# Altium project Warship_stm32f103zet6.PrjPcb
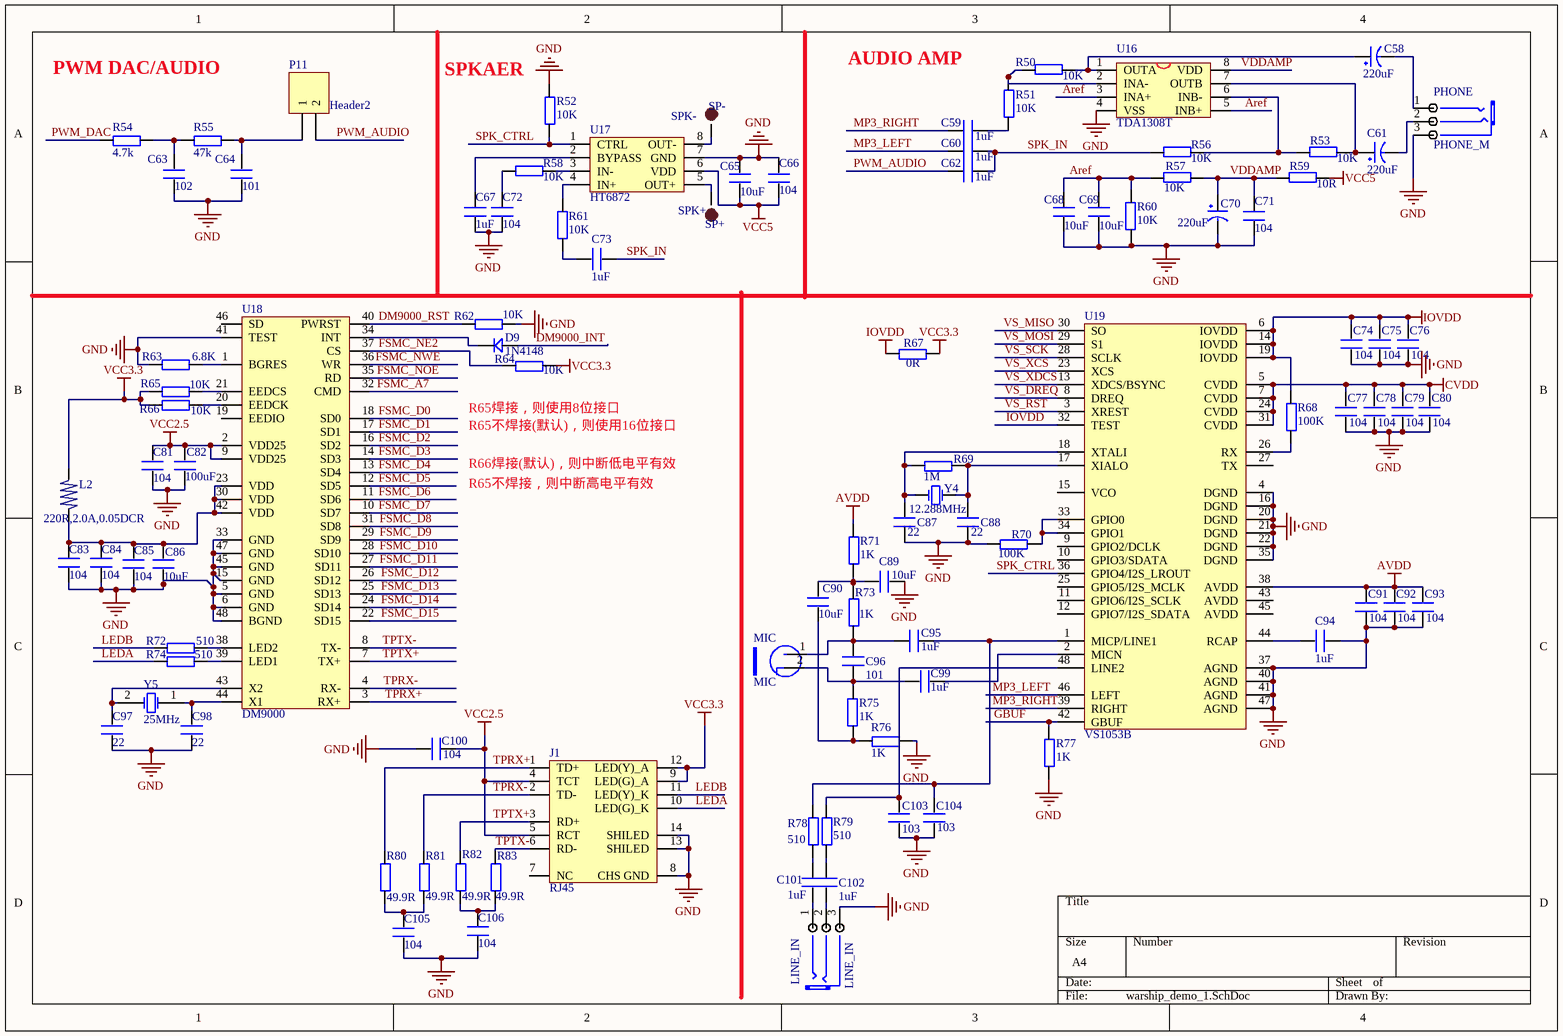
[diagram p0: warship_demo_1.SchDoc]
4 sheets, 272 parts. Net scope: global (net labels, ports and power ports of the same name join across sheets).
Sheets:
  warship_demo_1.SchDoc
  warship_demo_2.SchDoc
  warship_demo_3.SchDoc
  warship_demo_4.SchDoc

## Sheet warship_demo_1.SchDoc
size A4

### Parts
C58  220uF  [CC6.56.5]
C59  1uF  [0603P]
C60  1uF  [0603P]
C61  220uF  [CC6.56.5]
C62  1uF  [0603P]
C63  102  [0603P]
C64  101  [0603P]
C65  10uF  [0805]
C66  104  [0603P]
C67  1uF  [0603P]
C68  10uF  [0805]
C69  10uF  [0805]
C70  220uF  [CC6.56.5]
C71  104  [0603P]
C72  104  [0603P]
C73  1uF  [0603P]
C74  104  [0603P]
C75  104  [0603P]
C76  104  [0603P]
C77  104  [0603P]
C78  104  [0603P]
C79  104  [0603P]
C80  104  [0603P]
C81  104  [0603P]
C82  100uF  [1206]
C83  104  [0603P]
C84  104  [0603P]
C85  104  [0603P]
C86  10uF  [0805]
C87  22  [0603P]
C88  22  [0603P]
C89  10uF  [0805]
C90  10uF  [0805]
C91  104  [0603P]
C92  104  [0603P]
C93  104  [0603P]
C94  1uF  [0603P]
C95  1uF  [0603P]
C96  101  [0603P]
C97  22  [0603P]
C98  22  [0603P]
C99  1uF  [0603P]
C100  104  [0603P]
C101  1uF  [0603P]
C102  1uF  [0603P]
C103  103  [0603P]
C104  103  [0603P]
C105  104  [0603P]
C106  104  [0603P]
D9  1N4148  [DIODE_SOP]
J1  RJ45  [HR911105A]
L2  220R,2.0A,0.05DCR  [0603P]
LINE_IN  LINE_IN  [PHONE_ST]
MIC  MIC  [MIC]
P11  Header2  [HDR1X2]
PHONE  PHONE_M  [PHONE_ST]
R50  10K  [0603P]
R51  10K  [0603P]
R52  10K  [0603P]
R53  10K  [0603P]
R54  4.7k  [0603P]
R55  47k  [0603P]
R56  10K  [0603P]
R57  10K  [0603P]
R58  10K  [0603P]
R59  10R  [0603P]
R60  10K  [0603P]
R61  10K  [0603P]
R62  10K  [0603P]
R63  6.8K  [0603P]
R64  10K  [0603P]
R65  10K  [0603P]
R66  10K  [0603P]
R67  0R  [0603P]
R68  100K  [0603P]
R69  1M  [0603P]
R70  100K  [0603P]
R71  1K  [0603P]
R72  510  [0603P]
R73  1K  [0603P]
R74  510  [0603P]
R75  1K  [0603P]
R76  1K  [0603P]
R77  1K  [0603P]
R78  510  [0603P]
R79  510  [0603P]
R80  49.9R  [0603P]
R81  49.9R  [0603P]
R82  49.9R  [0603P]
R83  49.9R  [0603P]
SP+  SPK+  [TP-1.5]
SP-  SPK-  [TP-1.5]
U16  TDA1308T  [SOP-8]
U17  HT6872  [SOP-8]
U18  DM9000  [mTQFP48]
U19  VS1053B  [mTQFP48]
Y4  12.288MHz  [XTAL_US]
Y5  25MHz  [XTAL_US]

### Nets
AVDD: C91.2 C92.2 C93.2 R71.2 U19.38(AVDD)
CVDD: C77.2 C78.2 C79.2 C80.2 U19.5(CVDD) U19.7(CVDD) U19.24(CVDD) U19.31(CVDD)
GND: C63.1 C64.1 C65.2 C66.1 C67.1 C68.1 C69.1 C70.2(GND) C71.2 C72.1 C74.1 C75.1 C76.1 C77.1 C78.1 C79.1 C80.1 C81.1 C82.1 C83.1 C84.1 C85.1 C86.1 C87.1 C88.2 C89.1 C91.1 C92.1 C93.1 C94.1 C97.1 C98.1 C100.2 C103.1 C104.1 C105.1 C106.1 J1.8(CHS_GND) J1.13(SHILED) J1.14(SHILED) LINE_IN.3(COM) PHONE.3(COM) R52.2 R60.2 R62.2 R63.1 R70.1 R76.2 R77.1 U16.4(VSS) U17.7(GND) U18.5(GND) U18.6(GND) U18.15(GND) U18.33(GND) U18.41(TEST) U18.45(GND) U18.47(GND) U18.48(BGND) U19.4(DGND) U19.16(DGND) U19.20(DGND) U19.21(DGND) U19.22(DGND) U19.35(DGND) U19.37(AGND) U19.40(AGND) U19.41(AGND) U19.47(AGND)
IOVDD: C74.2 C75.2 C76.2 R67.1 R68.2 U19.6(IOVDD) U19.14(IOVDD) U19.19(IOVDD) U19.32(TEST)
VCC2.5: C81.2 C82.2 C100.1 J1.4(TCT) J1.5(RCT) U18.2(VDD25) U18.9(VDD25)
VCC3.3: J1.9(LED(G)_A) J1.12(LED(Y)_A) L2.1 R64.2 R65.1 R66.1 R67.2
VCC5: C65.1 C66.2 R59.1 U17.6(VDD)
Aref: C68.2 C69.2 R57.2 R60.1 U16.3(INA+) U16.5(INB+)
DM9000_INT: D9.1
DM9000_RST: R62.1 U18.40(PWRST)
FSMC_A7: U18.32(CMD)
FSMC_D0: U18.18(SD0)
FSMC_D1: U18.17(SD1)
FSMC_D2: U18.16(SD2)
FSMC_D3: U18.14(SD3)
FSMC_D4: U18.13(SD4)
FSMC_D5: U18.12(SD5)
FSMC_D6: U18.11(SD6)
FSMC_D7: U18.10(SD7)
FSMC_D8: U18.31(SD8)
FSMC_D9: U18.29(SD9)
FSMC_D10: U18.28(SD10)
FSMC_D11: U18.27(SD11)
FSMC_D12: U18.26(SD12)
FSMC_D13: U18.25(SD13)
FSMC_D14: U18.24(SD14)
FSMC_D15: U18.22(SD15)
FSMC_NE2: R64.1 U18.37(CS)
FSMC_NOE: U18.35(RD)
FSMC_NWE: U18.36(WR)
GBUF: R77.2 U19.42(GBUF)
LEDA: J1.10(LED(G)_K) R74.1
LEDB: J1.11(LED(Y)_K) R72.1
MP3_LEFT: C60.2 U19.46(LEFT)
MP3_RIGHT: C59.2 U19.39(RIGHT)
PWM_AUDIO: C62.2 P11.2
PWM_DAC: R54.1  [project net OV_VSYNC]
SPK_CTRL: R52.1 U17.1(CTRL) U19.36(GPIO4/I2S_LROUT)
SPK_IN: C60.1 C62.1 C73.1 R56.2
TPRX+: J1.1(TD+) R80.2 U18.3(RX+)
TPRX-: J1.2(TD-) R81.2 U18.4(RX-)
TPTX+: J1.3(RD+) R82.2 U18.7(TX+)
TPTX-: J1.6(RD-) R83.2 U18.8(TX-)
VDDAMP: C70.1(VCC) C71.1 R57.1 R59.2 U16.8(VDD)
VS_DREQ: U19.8(DREQ)  [project net PC13]
VS_MISO: U19.30(SO)  [project net PA6]
VS_MOSI: U19.29(S1)  [project net PA7]
VS_RST: U19.3(XREST)  [project net PE6]
VS_SCK: U19.28(SCLK)  [project net PA5]
VS_XCS: U19.23(XCS)  [project net PF7]
VS_XDCS: U19.13(XDCS/BSYNC)  [project net PF6]
NetC58_1: C58.1(VCC) R50.1 U16.1(OUTA)
NetC58_2: C58.2(GND) PHONE.1(CHL)
NetC59_1: C59.1 R51.1
NetC61_1: C61.1(VCC) R53.1 U16.7(OUTB)
NetC61_2: C61.2(GND) PHONE.2(CHR)
NetC63_2: C63.2 R54.2 R55.1
NetC64_2: C64.2 P11.1 R55.2
NetC67_2: C67.2 U17.2(BYPASS)
NetC72_2: C72.2 R58.2
NetC73_2: C73.2 R61.2
NetC83_2: C83.2 C84.2 C85.2 C86.2 L2.2 U18.23(VDD) U18.30(VDD) U18.42(VDD)
NetC87_2: C87.2 R69.1 U19.18(XTALI) Y4.1(OSC1)
NetC88_1: C88.1 R69.2 U19.17(XIALO) Y4.2(OSC2)
NetC89_2: C89.2 C90.2 R71.1 R73.2
NetC90_1: C90.1 R75.2 R76.1
NetC94_2: C94.2 U19.44(RCAP)
NetC95_1: C95.1 C96.2 MIC.1(VCC) R73.1
NetC95_2: C95.2 C104.2 R78.2 U19.1(MICP/LINE1)
NetC96_1: C96.1 C99.1 MIC.2(GND) R75.1
NetC97_2: C97.2 U18.43(X2) Y5.2(OSC2)
NetC98_2: C98.2 U18.44(X1) Y5.1(OSC1)
NetC99_2: C99.2 U19.2(MICN)
NetC101_1: C101.1 LINE_IN.1(CHL)
NetC101_2: C101.2 R78.1
NetC102_1: C102.1 LINE_IN.2(CHR)
NetC102_2: C102.2 R79.1
NetC103_2: C103.2 R79.2 U19.48(LINE2)
NetC105_2: C105.2 R80.1 R81.1
NetC106_2: C106.2 R82.1 R83.1
NetD9_2: D9.2 U18.34(INT)
NetR50_2: R50.2 R51.2 U16.2(INA-)
NetR53_2: R53.2 R56.1 U16.6(INB-)
NetR58_1: R58.1 U17.3(IN-)
NetR61_1: R61.1 U17.4(IN+)
NetR63_2: R63.2 U18.1(BGRES)
NetR65_2: R65.2 U18.21(EEDCS)
NetR66_2: R66.2 U18.20(EEDCK)
NetR68_1: R68.1 U19.26(RX)
NetR70_2: R70.2 U19.33(GPIO0) U19.34(GPIO1)
NetR72_2: R72.2 U18.38(LED2)
NetR74_2: R74.2 U18.39(LED1)
NetSP+_1: SP+.1 U17.5(OUT+)
NetSP-_1: SP-.1 U17.8(OUT-)

Not connected (* = marked no-connect by the designer): J1 7(NC); U18 19(EEDIO) 46(SD); U19 9(GPIO2/DCLK) 10(GPIO3/SDATA) 11(GPIO6/I2S_SCLK) 12(GPIO7/I2S_SDATA) 15(VCO) 25(GPIO5/I2S_MCLK) 27(TX) 43(AVDD) 45(AVDD)

### Notes on the sheet
- PWM DAC/AUDIO
- (near R52) SPKAER
- AUDIO AMP
- R65焊接，则使用8位接口
- R65不焊接(默认)，则使用16位接口
- R66焊接(默认)，则中断低电平有效
- R65不焊接，则中断高电平有效

### Library data of the parts
C58 C61 C70 = CAP
C59 C60 C62-C69 C71-C106 = C
D9 = D
J1 = HR911105
L2 = L
LINE_IN = PHONE_M
P11 = Header 2: Header, 2-Pin; LatestRevisionDate: 17-Jul-2002; LatestRevisionNote: Re-released for DXP Platform.; Publisher: Altium Limited
R50-R83 = R
SP+ SP- = TEST-POINT: 测试点
U16 = TDA1308
U17 = HT6871
U18 = DM9000A
U19 = VS1053
Y4 Y5 = XTAL: Crystal Oscillator; Published: 8-Jun-2000; LatestRevisionDate: 17-Jul-2002; LatestRevisionNote: Re-released for DXP Platform.; Publisher: Altium Limited

## Sheet warship_demo_2.SchDoc
size A3
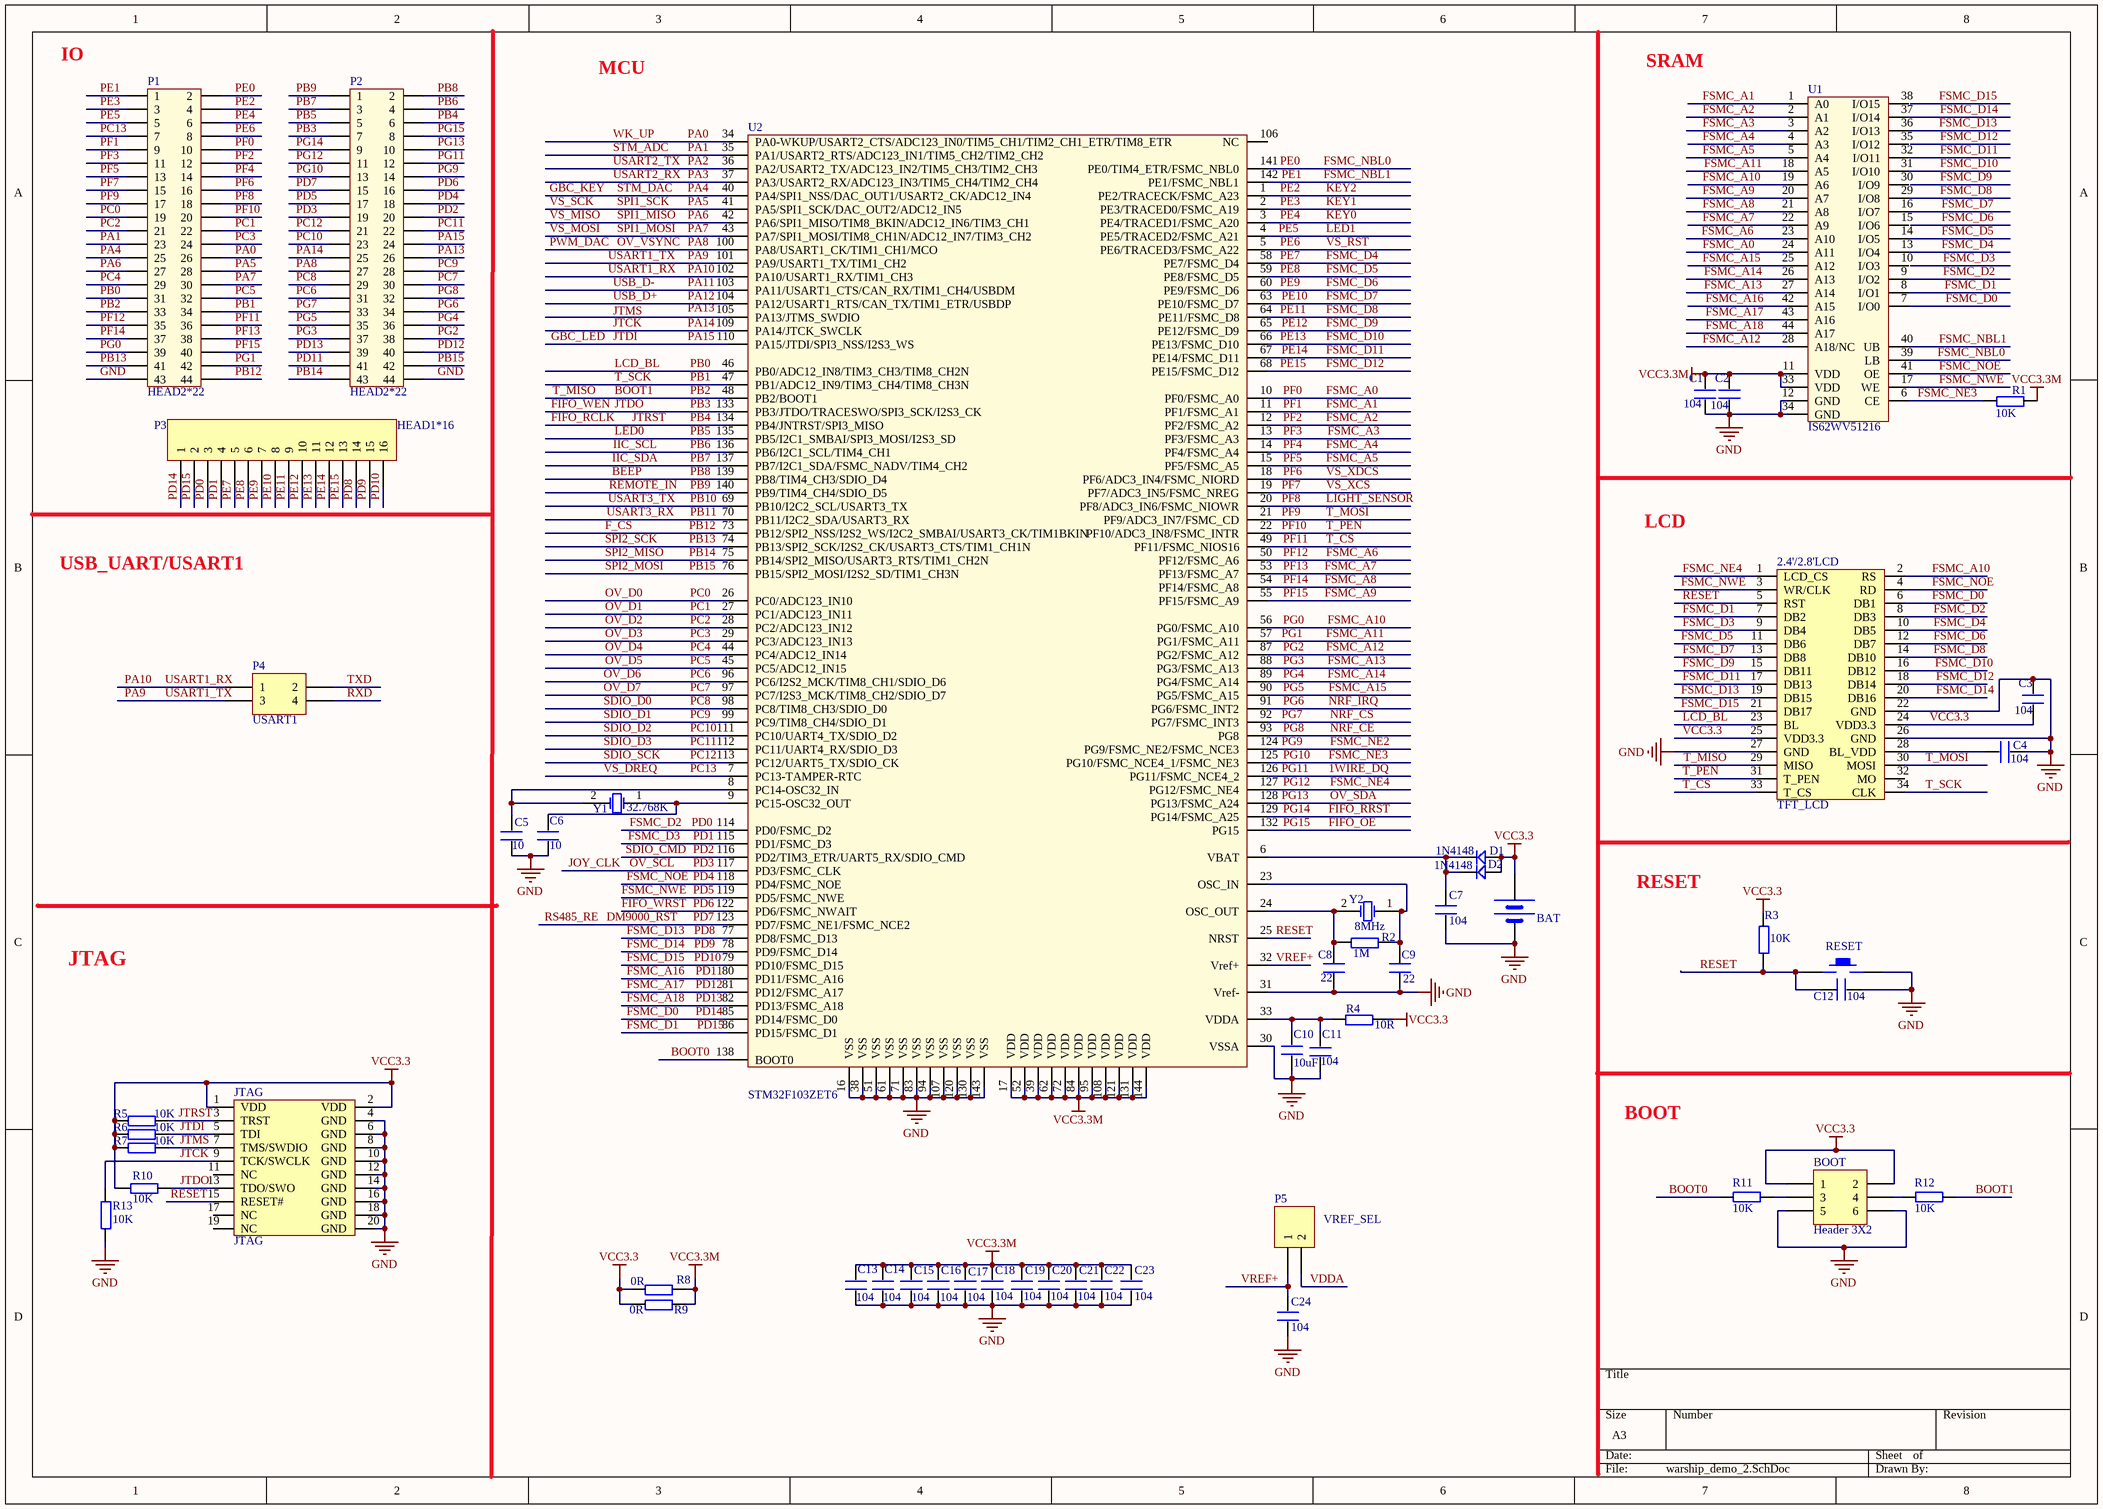
[diagram p1: warship_demo_2.SchDoc]

### Parts
2.4'/2.8'LCD  TFT_LCD  [db2*17-4.3]
BAT  BATT  [BATM]  (value not drawn)
BOOT  Header 3X2  [HDR2X3]
C1  104  [0603P]
C2  104  [0603P]
C3  104  [0603P]
C4  104  [0603P]
C5  10  [0603P]
C6  10  [0603P]
C7  104  [0603P]
C8  22  [0603P]
C9  22  [0603P]
C10  10uF  [0603P]
C11  104  [0603P]
C12  104  [0603P]
C13  104  [0603P]
C14  104  [0603P]
C15  104  [0603P]
C16  104  [0603P]
C17  104  [0603P]
C18  104  [0603P]
C19  104  [0603P]
C20  104  [0603P]
C21  104  [0603P]
C22  104  [0603P]
C23  104  [0603P]
C24  104  [0603P]
D1  1N4148  [DIODE_SOP]
D2  1N4148  [DIODE_SOP]
JTAG  JTAG  [JTAG_20]
P1  HEAD2*22  [HEAD2*22]
P2  HEAD2*22  [HEAD2*22]
P3  HEAD1*16  [HDR1X16]
P4  USART1  [HDR2X2]
P5  VREF_SEL  [HDR1X2]
R1  10K  [0603P]
R2  1M  [0603P]
R3  10K  [0603P]
R4  10R  [0603P]
R5  10K  [0603P]
R6  10K  [0603P]
R7  10K  [0603P]
R8  0R  [0603P]
R9  0R  [0603P]
R10  10K  [0603P]
R11  10K  [0603P]
R12  10K  [0603P]
R13  10K  [0603P]
RESET  KEY_M  [KEY_M]  (value not drawn)
U1  IS62WV51216  [TSOP44]
U2  STM32F103ZET6  [LQFP144]
Y1  32.768K  [XTAL_US]
Y2  8MHz  [XTAL_US]

### Nets
GND: 2.4'/2.8'LCD.22(GND) 2.4'/2.8'LCD.26(GND) 2.4'/2.8'LCD.27(GND) BAT.2(GND) BOOT.5 BOOT.6 C1.1 C2.2 C3.1 C4.2 C5.1 C6.1 C7.1 C8.1 C9.2 C10.1 C11.2 C12.2 C13.1 C14.1 C15.1 C16.1 C17.1 C18.1 C19.1 C20.1 C21.1 C22.1 C23.1 C24.1 JTAG.4(GND) JTAG.6(GND) JTAG.8(GND) JTAG.10(GND) JTAG.12(GND) JTAG.14(GND) JTAG.16(GND) JTAG.18(GND) JTAG.20(GND) P1.43 P2.44 R13.1 RESET.2 U1.12(GND) U1.34(GND) U2.16(VSS) U2.30(VSSA) U2.31(Vref-) U2.38(VSS) U2.51(VSS) U2.61(VSS) U2.71(VSS) U2.83(VSS) U2.94(VSS) U2.107(VSS) U2.120(VSS) U2.130(VSS) U2.143(VSS)
VCC3.3: 2.4'/2.8'LCD.24(VDD3.3) 2.4'/2.8'LCD.25(VDD3.3) BAT.1(VCC) BOOT.1 BOOT.2 C3.2 D1.1 D2.1 JTAG.1(VDD) JTAG.2(VDD) R3.2 R4.2 R5.1 R6.1 R7.1 R8.1 R9.1 R10.1
VCC3.3M: C1.2 C2.1 C13.2 C14.2 C15.2 C16.2 C17.2 C18.2 C19.2 C20.2 C21.2 C22.2 C23.2 R1.2 R8.2 R9.2 U1.11(VDD) U1.33(VDD) U2.17(VDD) U2.39(VDD) U2.52(VDD) U2.62(VDD) U2.72(VDD) U2.84(VDD) U2.95(VDD) U2.108(VDD) U2.121(VDD) U2.131(VDD) U2.144(VDD)
1WIRE_DQ: P2.12 U2.126(PG11/FSMC_NCE4_2)  [also labelled PG11]
BEEP: P2.2 U2.139(PB8/TIM4_CH3/SDIO_D4)  [also labelled PB8]
BOOT0: R11.2 U2.138(BOOT0)
BOOT1: 2.4'/2.8'LCD.29(MISO) P1.33 R12.1 U2.48(PB2/BOOT1)  [also labelled PB2, T_MISO]
DM9000_RST: P2.15 U2.123(PD7/FSMC_NE1/FSMC_NCE2)  [also labelled PD7, RS485_RE]
F_CS: P1.44 U2.73(PB12/SPI2_NSS/I2S2_WS/I2C2_SMBAI/USART3_CK/TIM1BKIN)  [also labelled PB12]
FIFO_OE: P2.8 U2.132(PG15)  [also labelled PG15]
FIFO_RCLK: JTAG.3(TRST) P2.6 R5.2 U2.134(PB4/JNTRST/SPI3_MISO)  [also labelled JTRST, PB4]
FIFO_RRST: P2.9 U2.129(PG14/FSMC_A25)  [also labelled PG14]
FIFO_WEN: JTAG.13(TDO/SWO) P2.7 R10.2 U2.133(PB3/JTDO/TRACESWO/SPI3_SCK/I2S3_CK)  [also labelled JTDO, PB3]
FIFO_WRST: P2.16 U2.122(PD6/FSMC_NWAIT)  [also labelled PD6]
FSMC_A0: P1.10 U1.24(A11) U2.10(PF0/FSMC_A0)  [also labelled PF0]
FSMC_A1: P1.9 U1.1(A0) U2.11(PF1/FSMC_A1)  [also labelled PF1]
FSMC_A2: P1.12 U1.2(A1) U2.12(PF2/FSMC_A2)  [also labelled PF2]
FSMC_A3: P1.11 U1.3(A2) U2.13(PF3/FSMC_A3)  [also labelled PF3]
FSMC_A4: P1.14 U1.4(A3) U2.14(PF4/FSMC_A4)  [also labelled PF4]
FSMC_A5: P1.13 U1.5(A4) U2.15(PF5/FSMC_A5)  [also labelled PF5]
FSMC_A6: P1.35 U1.23(A10) U2.50(PF12/FSMC_A6)  [also labelled PF12]
FSMC_A7: P1.38 U1.22(A9) U2.53(PF13/FSMC_A7)  [also labelled PF13]
FSMC_A8: P1.37 U1.21(A8) U2.54(PF14/FSMC_A8)  [also labelled PF14]
FSMC_A9: P1.40 U1.20(A7) U2.55(PF15/FSMC_A9)  [also labelled PF15]
FSMC_A10: 2.4'/2.8'LCD.2(RS) P1.39 U1.19(A6) U2.56(PG0/FSMC_A10)  [also labelled PG0]
FSMC_A11: P1.42 U1.18(A5) U2.57(PG1/FSMC_A11)  [also labelled PG1]
FSMC_A12: P2.38 U1.28(A18/NC) U2.87(PG2/FSMC_A12)  [also labelled PG2]
FSMC_A13: P2.37 U1.27(A14) U2.88(PG3/FSMC_A13)  [also labelled PG3]
FSMC_A14: P2.36 U1.26(A13) U2.89(PG4/FSMC_A14)  [also labelled PG4]
FSMC_A15: P2.35 U1.25(A12) U2.90(PG5/FSMC_A15)  [also labelled PG5]
FSMC_A16: P2.41 U1.42(A15) U2.80(PD11/FSMC_A16)  [also labelled PD11]
FSMC_A17: P2.40 U1.43(A16) U2.81(PD12/FSMC_A17)  [also labelled PD12]
FSMC_A18: P2.39 U1.44(A17) U2.82(PD13/FSMC_A18)  [also labelled PD13]
FSMC_D0: 2.4'/2.8'LCD.6(DB1) P3.1 U1.7(I/O0) U2.85(PD14/FSMC_D0)  [also labelled PD14]
FSMC_D1: 2.4'/2.8'LCD.7(DB2) P3.2 U1.8(I/O1) U2.86(PD15/FSMC_D1)  [also labelled PD15]
FSMC_D2: 2.4'/2.8'LCD.8(DB3) P3.3 U1.9(I/O2) U2.114(PD0/FSMC_D2)  [also labelled PD0]
FSMC_D3: 2.4'/2.8'LCD.9(DB4) P3.4 U2.115(PD1/FSMC_D3)  [also labelled PD1]
FSMC_D4: 2.4'/2.8'LCD.10(DB5) P3.5 U1.13(I/O4) U2.58(PE7/FSMC_D4)  [also labelled PE7]
FSMC_D5: 2.4'/2.8'LCD.11(DB6) P3.6 U1.14(I/O5) U2.59(PE8/FSMC_D5)  [also labelled PE8]
FSMC_D6: 2.4'/2.8'LCD.12(DB7) P3.7 U2.60(PE9/FSMC_D6)  [also labelled PE9]
FSMC_D7: 2.4'/2.8'LCD.13(DB8) P3.8 U1.16(I/O7) U2.63(PE10/FSMC_D7)  [also labelled PE10]
FSMC_D8: 2.4'/2.8'LCD.14(DB10) P3.9 U1.29(I/O8) U2.64(PE11/FSMC_D8)  [also labelled PE11]
FSMC_D9: 2.4'/2.8'LCD.15(DB11) P3.10 U2.65(PE12/FSMC_D9)  [also labelled PE12]
FSMC_D10: 2.4'/2.8'LCD.16(DB12) P3.11 U1.31(I/O10) U2.66(PE13/FSMC_D10)  [also labelled PE13]
FSMC_D11: 2.4'/2.8'LCD.17(DB13) P3.12 U1.32(I/O11) U2.67(PE14/FSMC_D11)  [also labelled PE14]
FSMC_D12: 2.4'/2.8'LCD.18(DB14) P3.13 U2.68(PE15/FSMC_D12)  [also labelled PE15]
FSMC_D13: 2.4'/2.8'LCD.19(DB15) P3.14 U1.36(I/O13) U2.77(PD8/FSMC_D13)  [also labelled PD8]
FSMC_D14: 2.4'/2.8'LCD.20(DB16) P3.15 U1.37(I/O14) U2.78(PD9/FSMC_D14)  [also labelled PD9]
FSMC_D15: 2.4'/2.8'LCD.21(DB17) P3.16 U2.79(PD10/FSMC_D15)  [also labelled PD10]
FSMC_NBL0: P1.2 U1.39(LB) U2.141(PE0/TIM4_ETR/FSMC_NBL0)  [also labelled PE0]
FSMC_NBL1: P1.1 U1.40(UB) U2.142(PE1/FSMC_NBL1)  [also labelled PE1]
FSMC_NE2: P2.14 U2.124(PG9/FSMC_NE2/FSMC_NCE3)  [also labelled PG9]
FSMC_NE3: P2.13 R1.1 U1.6(CE) U2.125(PG10/FSMC_NCE4_1/FSMC_NE3)  [also labelled PG10]
FSMC_NE4: 2.4'/2.8'LCD.1(LCD_CS) P2.11 U2.127(PG12/FSMC_NE4)  [also labelled PG12]
FSMC_NOE: 2.4'/2.8'LCD.4(RD) P2.18 U1.41(OE) U2.118(PD4/FSMC_NOE)  [also labelled PD4]
FSMC_NWE: 2.4'/2.8'LCD.3(WR/CLK) P2.17 U1.17(WE) U2.119(PD5/FSMC_NWE)  [also labelled PD5]
GBC_KEY: P1.25 U2.40(PA4/SPI1_NSS/DAC_OUT1/USART2_CK/ADC12_IN4)  [also labelled PA4, STM_DAC]
GBC_LED: JTAG.5(TDI) P2.24 R6.2 U2.110(PA15/JTDI/SPI3_NSS/I2S3_WS)  [also labelled JTDI, PA15]
IIC_SCL: P2.4 U2.136(PB6/I2C1_SCL/TIM4_CH1)  [also labelled PB6]
IIC_SDA: P2.3 U2.137(PB7/I2C1_SDA/FSMC_NADV/TIM4_CH2)  [also labelled PB7]
JOY_CLK: P2.19 U2.117(PD3/FSMC_CLK)  [also labelled OV_SCL, PD3]
JTCK: JTAG.9(TCK/SWCLK) P2.25 R13.2 U2.109(PA14/JTCK_SWCLK)  [also labelled PA14]
JTMS: JTAG.7(TMS/SWDIO) R7.2
KEY0: P1.6 U2.3(PE4/TRACED1/FSMC_A20)  [also labelled PE4]
KEY1: P1.3 U2.2(PE3/TRACED0/FSMC_A19)  [also labelled PE3]
KEY2: P1.4 U2.1(PE2/TRACECK/FSMC_A23)  [also labelled PE2]
LCD_BL: 2.4'/2.8'LCD.23(BL) P1.31 U2.46(PB0/ADC12_IN8/TIM3_CH3/TIM8_CH2N)  [also labelled PB0]
LED0: P2.5 U2.135(PB5/I2C1_SMBAI/SPI3_MOSI/I2S3_SD)  [also labelled PB5]
LED1: P1.5 U2.4(PE5/TRACED2/FSMC_A21)  [also labelled PE5]
LIGHT_SENSOR: P1.18 U2.20(PF8/ADC3_IN6/FSMC_NIOWR)  [also labelled PF8]
NRF_CE: P2.32 U2.93(PG8)  [also labelled PG8]
NRF_CS: P2.33 U2.92(PG7/FSMC_INT3)  [also labelled PG7]
NRF_IRQ: P2.34 U2.91(PG6/FSMC_INT2)  [also labelled PG6]
OV_D0: P1.19 U2.26(PC0/ADC123_IN10)  [also labelled PC0]
OV_D1: P1.22 U2.27(PC1/ADC123_IN11)  [also labelled PC1]
OV_D2: P1.21 U2.28(PC2/ADC123_IN12)  [also labelled PC2]
OV_D3: P1.24 U2.29(PC3/ADC123_IN13)  [also labelled PC3]
OV_D4: P1.29 U2.44(PC4/ADC12_IN14)  [also labelled PC4]
OV_D5: P1.32 U2.45(PC5/ADC12_IN15)  [also labelled PC5]
OV_D6: P2.31 U2.96(PC6/I2S2_MCK/TIM8_CH1/SDIO_D6)  [also labelled PC6]
OV_D7: P2.30 U2.97(PC7/I2S3_MCK/TIM8_CH2/SDIO_D7)  [also labelled PC7]
OV_SDA: P2.10 U2.128(PG13/FSMC_A24)  [also labelled PG13]
OV_VSYNC: P2.27 U2.100(PA8/USART1_CK/TIM1_CH1/MCO)  [also labelled PA8, PWM_DAC]
PA0: P1.26 U2.34(PA0-WKUP/USART2_CTS/ADC123_IN0/TIM5_CH1/TIM2_CH1_ETR/TIM8_ETR)  [also labelled WK_UP]
PA1: P1.23 U2.35(PA1/USART2_RTS/ADC123_IN1/TIM5_CH2/TIM2_CH2)  [also labelled STM_ADC]
PA2: U2.36(PA2/USART2_TX/ADC123_IN2/TIM5_CH3/TIM2_CH3)  [also labelled USART2_TX]
PA3: U2.37(PA3/USART2_RX/ADC123_IN3/TIM5_CH4/TIM2_CH4)  [also labelled USART2_RX]
PA5: P1.28 U2.41(PA5/SPI1_SCK/DAC_OUT2/ADC12_IN5)  [also labelled SPI1_SCK, VS_SCK]
PA6: P1.27 U2.42(PA6/SPI1_MISO/TIM8_BKIN/ADC12_IN6/TIM3_CH1)  [also labelled SPI1_MISO, VS_MISO]
PA7: P1.30 U2.43(PA7/SPI1_MOSI/TIM8_CH1N/ADC12_IN7/TIM3_CH2)  [also labelled SPI1_MOSI, VS_MOSI]
PA9: P4.3 U2.101(PA9/USART1_TX/TIM1_CH2)  [also labelled USART1_TX]
PA10: P4.1 U2.102(PA10/USART1_RX/TIM1_CH3)  [also labelled USART1_RX]
PA11: U2.103(PA11/USART1_CTS/CAN_RX/TIM1_CH4/USBDM)  [also labelled USB_D-]
PA12: U2.104(PA12/USART1_RTS/CAN_TX/TIM1_ETR/USBDP)  [also labelled USB_D+]
PA13: P2.26
PB1: 2.4'/2.8'LCD.34(CLK) P1.34 U2.47(PB1/ADC12_IN9/TIM3_CH4/TIM8_CH3N)  [also labelled T_SCK]
PB9: P2.1 U2.140(PB9/TIM4_CH4/SDIO_D5)  [also labelled REMOTE_IN]
PB10: U2.69(PB10/I2C2_SCL/USART3_TX)  [also labelled USART3_TX]
PB11: U2.70(PB11/I2C2_SDA/USART3_RX)  [also labelled USART3_RX]
PB13: P1.41 U2.74(PB13/SPI2_SCK/I2S2_CK/USART3_CTS/TIM1_CH1N)  [also labelled SPI2_SCK]
PB14: P2.43 U2.75(PB14/SPI2_MISO/USART3_RTS/TIM1_CH2N)  [also labelled SPI2_MISO]
PB15: P2.42 U2.76(PB15/SPI2_MOSI/I2S2_SD/TIM1_CH3N)  [also labelled SPI2_MOSI]
PC8: P2.29 U2.98(PC8/TIM8_CH3/SDIO_D0)  [also labelled SDIO_D0]
PC9: P2.28 U2.99(PC9/TIM8_CH4/SDIO_D1)  [also labelled SDIO_D1]
PC10: P2.23 U2.111(PC10/UART4_TX/SDIO_D2)  [also labelled SDIO_D2]
PC11: P2.22 U2.112(PC11/UART4_RX/SDIO_D3)  [also labelled SDIO_D3]
PC12: P2.21 U2.113(PC12/UART5_TX/SDIO_CK)  [also labelled SDIO_SCK]
PC13: P1.7 U2.7(PC13-TAMPER-RTC)  [also labelled VS_DREQ]
PD2: P2.20 U2.116(PD2/TIM3_ETR/UART5_RX/SDIO_CMD)  [also labelled SDIO_CMD]
PE6: P1.8 U2.5(PE6/TRACED3/FSMC_A22)  [also labelled VS_RST]
PF6: P1.16 U2.18(PF6/ADC3_IN4/FSMC_NIORD)  [also labelled VS_XDCS]
PF7: P1.15 U2.19(PF7/ADC3_IN5/FSMC_NREG)  [also labelled VS_XCS]
PF9: 2.4'/2.8'LCD.30(MOSI) P1.17 U2.21(PF9/ADC3_IN7/FSMC_CD)  [also labelled T_MOSI]
PF10: 2.4'/2.8'LCD.31(T_PEN) P1.20 U2.22(PF10/ADC3_IN8/FSMC_INTR)  [also labelled T_PEN]
PF11: 2.4'/2.8'LCD.33(T_CS) P1.36 U2.49(PF11/FSMC_NIOS16)  [also labelled T_CS]
RESET: 2.4'/2.8'LCD.5(RST) C12.1 JTAG.15(RESET#) R3.1 RESET.1 U2.25(NRST)
RXD: P4.4
TXD: P4.2
VDDA: P5.2
VREF+: C24.2 P5.1 U2.32(Vref+)
Net2.4'/2.8'LCD_28: 2.4'/2.8'LCD.28(BL_VDD) C4.1
NetBOOT_3: BOOT.3 R11.1
NetBOOT_4: BOOT.4 R12.2
NetC5_2: C5.2 U2.8(PC14-OSC32_IN) Y1.2(OSC2)
NetC6_2: C6.2 U2.9(PC15-OSC32_OUT) Y1.1(OSC1)
NetC7_2: C7.2 D1.2 D2.2 U2.6(VBAT)
NetC8_2: C8.2 R2.1 U2.24(OSC_OUT) Y2.2(OSC2)
NetC9_1: C9.1 R2.2 U2.23(OSC_IN) Y2.1(OSC1)
NetC10_2: C10.2 C11.1 R4.1 U2.33(VDDA)

Not connected (* = marked no-connect by the designer): 2.4'/2.8'LCD 32(MO); JTAG 11(NC) 17(NC) 19(NC); U1 10(I/O3) 15(I/O6) 30(I/O9) 35(I/O12) 38(I/O15); U2 105(PA13/JTMS_SWDIO) 106(NC)

### Notes on the sheet
- IO
- MCU
- SRAM
- USB_UART/USART1
- LCD
- RESET
- JTAG
- BOOT
- Labels drawn without touching a wire or pin: JTMS, PA13

### Library data of the parts
BAT = BAT
BOOT = Header 3X2: Header, 3-Pin, Dual row; LatestRevisionDate: 17-Jul-2002; LatestRevisionNote: Re-released for DXP Platform.; Publisher: Altium Limited
C1-C24 = C
D1 D2 = D
P3 = Header 16: Header, 16-Pin; LatestRevisionDate: 17-Jul-2002; LatestRevisionNote: Re-released for DXP Platform.; Publisher: Altium Limited
P4 = Header 2X2: Header, 2-Pin, Dual row; LatestRevisionDate: 17-Jul-2002; LatestRevisionNote: Re-released for DXP Platform.; Publisher: Altium Limited
P5 = Header 2: Header, 2-Pin; LatestRevisionDate: 17-Jul-2002; LatestRevisionNote: Re-released for DXP Platform.; Publisher: Altium Limited
R1-R13 = R
U1 = IS61LV51216
Y1 Y2 = XTAL: Crystal Oscillator; Published: 8-Jun-2000; LatestRevisionDate: 17-Jul-2002; LatestRevisionNote: Re-released for DXP Platform.; Publisher: Altium Limited

## Sheet warship_demo_3.SchDoc
size A4
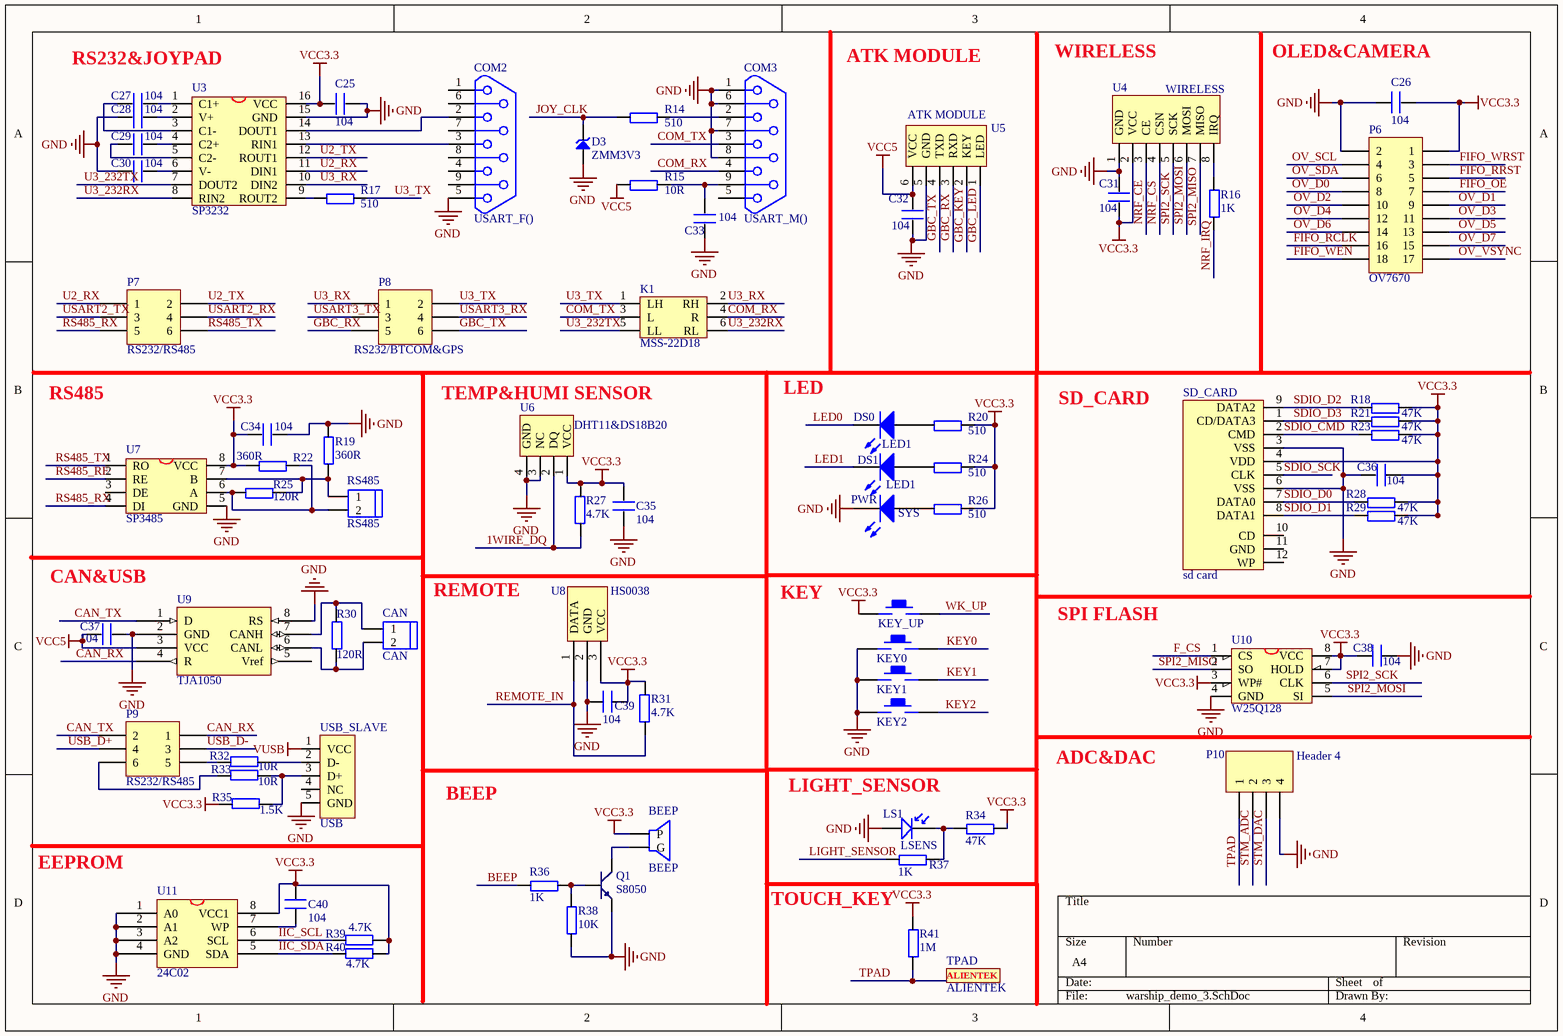
[diagram p2: warship_demo_3.SchDoc]

### Parts
BEEP  BEEP  [BELL-5]
C25  104  [0603P]
C26  104  [0603P]
C27  104  [0603P]
C28  104  [0603P]
C29  104  [0603P]
C30  104  [0603P]
C31  104  [0603P]
C32  104  [0603P]
C33  104  [0603P]
C34  104  [0603P]
C35  104  [0603P]
C36  104  [0603P]
C37  104  [0603P]
C38  104  [0603P]
C39  104  [0603P]
C40  104  [0603P]
CAN  CAN  [HEAD2L-0.8]
COM2  USART_F()  [DB9]
COM3  USART_M()  [DB9]
D3  ZMM3V3  [DIODE_ZMMx]
DS0  LED1  [SMDLED]
DS1  LED1  [SMDLED]
K1  MSS-22D18  [MSS-22D18-DIP]
KEY0  KEY_UP  [KEY_M]  (value not drawn)
KEY1  KEY_UP  [KEY_M]  (value not drawn)
KEY2  KEY_UP  [KEY_M]  (value not drawn)
KEY_UP  KEY_UP  [KEY_M]  (value not drawn)
LS1  LSENS  [SMDLED]
P6  OV7670  [HDR2X9]
P7  RS232/RS485  [HDR2X3]
P8  RS232/BTCOM&GPS  [HDR2X3]
P9  RS232/RS485  [HDR2X3]
P10  Header 4  [HDR1X4]
PWR  SYS  [SMDLED]
Q1  S8050  [SOT-23R]
R14  510  [0603P]
R15  10R  [0603P]
R16  1K  [0603P]
R17  510  [0603P]
R18  47K  [0603P]
R19  360R  [0603P]
R20  510  [0603P]
R21  47K  [0603P]
R22  360R  [0603P]
R23  47K  [0603P]
R24  510  [0603P]
R25  120R  [0603P]
R26  510  [0603P]
R27  4.7K  [0603P]
R28  47K  [0603P]
R29  47K  [0603P]
R30  120R  [0603P]
R31  4.7K  [0603P]
R32  10R  [0603P]
R33  10R  [0603P]
R34  47K  [0603P]
R35  1.5K  [0603P]
R36  1K  [0603P]
R37  1K  [0603P]
R38  10K  [0603P]
R39  4.7K  [0603P]
R40  4.7K  [0603P]
R41  1M  [0603P]
RS485  RS485  [HEAD2L-0.8]
SD_CARD  sd card  [SDCARD_L]
TPAD  ALIENTEK  [ALIENTEK_PAD1]
U3  SP3232  [SOP16M]
U4  WIRELESS  [NRF24L01]
U5  ATK MODULE  [HEAD6]
U6  DHT11&DS18B20  [DHT11]
U7  SP3485  [SOP-8]
U8  HS0038  [HS0038]
U9  TJA1050  [SOP-8]
U10  W25Q128  [SOIC-8]
U11  24C02  [SOP-8]
USB_SLAVE  USB  [USB/SM0.8-6H5]

### Nets
GND: C25.1 C26.2 C28.2 C30.2 C31.2 C32.1 C33.2 C34.1 C35.2 C36.2 C37.1 C38.1 C39.1 COM2.5 COM3.1 COM3.6 COM3.7 COM3.8 D3.1 KEY0.1 KEY1.1 KEY2.1 LS1.1 P6.2 P10.4 PWR.2(K) Q1.1(E) R19.2 R38.1 SD_CARD.3(VSS) SD_CARD.6(VSS) U3.15(GND) U4.1(GND) U5.5(GND) U6.3(NC) U6.4(GND) U7.5(GND) U8.2(GND) U9.2(GND) U9.8(RS) U10.4(GND) U11.1(A0) U11.2(A1) U11.3(A2) U11.4(GND) USB_SLAVE.5(GND)
VCC3.3: BEEP.1(P) C25.2 C26.1 C31.1 C34.2 C35.1 C36.1 C38.2 C39.2 C40.1 KEY_UP.1 P6.1 R18.2 R20.2 R21.2 R22.1 R23.2 R24.2 R26.2 R27.1 R28.2 R29.2 R31.1 R34.2 R35.2 R39.1 R40.1 R41.2 SD_CARD.4(VDD) U3.16(VCC) U4.2(VCC) U6.1(VCC) U7.8(VCC) U8.3(VCC) U10.3(WP#) U10.7(HOLD) U10.8(VCC) U11.8(VCC1)
VCC5: C32.2 C37.2 R15.1 U5.6(VCC) U9.3(VCC)
VUSB: USB_SLAVE.1(VCC)
1WIRE_DQ: R27.2 U6.2(DQ)
BEEP: R36.1
CAN_RX: P9.1 U9.4(R)
CAN_TX: P9.2 U9.1(D)
COM_RX: COM3.4 K1.4(R)
COM_TX: COM3.3 K1.3(L)
F_CS: U10.1(CS)
FIFO_OE: P6.7
FIFO_RCLK: P6.16
FIFO_RRST: P6.5
FIFO_WEN: P6.18
FIFO_WRST: P6.3
GBC_KEY: P10.3 U5.2(KEY)  [also labelled STM_DAC]
GBC_LED: U5.1(LED)
GBC_RX: P8.5 U5.3(RXD)
GBC_TX: P8.6 U5.4(TXD)
IIC_SCL: R39.2 U11.6(SCL)
IIC_SDA: R40.2 U11.5(SDA)
JOY_CLK: D3.2 P6.4 R14.1  [also labelled OV_SCL]
KEY0: KEY0.2
KEY1: KEY1.2
KEY2: KEY2.2
LED0: DS0.2(K)
LED1: DS1.2(K)
LIGHT_SENSOR: R37.1
NRF_CE: U4.3(CE)
NRF_CS: U4.4(CSN)
NRF_IRQ: R16.1
OV_D0: P6.8
OV_D1: P6.9
OV_D2: P6.10
OV_D3: P6.11
OV_D4: P6.12
OV_D5: P6.13
OV_D6: P6.14
OV_D7: P6.15
OV_SDA: P6.6
OV_VSYNC: P6.17
REMOTE_IN: R31.2 U8.1(DATA)  [project net PB9]
RS485_RE: U7.2(RE)  [project net DM9000_RST]
RS485_RX: P7.5 U7.4(DI)
RS485_TX: P7.6 U7.1(RO)
SDIO_CMD: R23.1 SD_CARD.2(CMD)  [project net PD2]
SDIO_D0: R28.1 SD_CARD.7(DATA0)  [project net PC8]
SDIO_D1: R29.1 SD_CARD.8(DATA1)  [project net PC9]
SDIO_D2: R18.1 SD_CARD.9(DATA2)  [project net PC10]
SDIO_D3: R21.1 SD_CARD.1(CD/DATA3)  [project net PC11]
SDIO_SCK: SD_CARD.5(CLK)  [project net PC12]
SPI2_MISO: U4.7(MISO) U10.2(SO)  [project net PB14]
SPI2_MOSI: U4.6(MOSI) U10.5(SI)  [project net PB15]
SPI2_SCK: U4.5(SCK) U10.6(CLK)  [project net PB13]
STM_ADC: P10.2  [project net PA1]
TPAD: P10.1 R41.1
U2_RX: P7.1 U3.11(DIN1)
U2_TX: P7.2 U3.12(ROUT1)
U3_232RX: K1.6(RL) U3.8(RIN2)
U3_232TX: K1.5(LL) U3.7(DOUT2)
U3_RX: K1.2(RH) P8.1 U3.10(DIN2)
U3_TX: K1.1(LH) P8.2 R17.2
USART2_RX: P7.4  [project net PA3]
USART2_TX: P7.3  [project net PA2]
USART3_RX: P8.4  [project net PB11]
USART3_TX: P8.3  [project net PB10]
USB_D+: P9.4  [project net PA12]
USB_D-: P9.3  [project net PA11]
WK_UP: KEY_UP.2  [project net PA0]
NetBEEP_2: BEEP.2(G) Q1.3(C)
NetC27_1: C27.1 U3.1(C1+)
NetC27_2: C27.2 U3.3(C1-)
NetC28_1: C28.1 U3.2(V+)
NetC29_1: C29.1 U3.4(C2+)
NetC29_2: C29.2 U3.5(C2-)
NetC30_1: C30.1 U3.6(V-)
NetC33_1: C33.1 COM3.9 R15.2
NetC40_2: C40.2 U11.7(WP)
NetCAN_1: CAN.1 R30.2 U9.7(CANH)
NetCAN_2: CAN.2 R30.1 U9.6(CANL)
NetCOM2_2: COM2.2 U3.14(DOUT1)
NetCOM2_3: COM2.3 U3.13(RIN1)
NetCOM3_2: COM3.2 R14.2
NetDS0_1: DS0.1(A) R20.1
NetDS1_1: DS1.1(A) R24.1
NetLS1_2: LS1.2 R34.1 R37.2
NetP9_5: P9.5 R32.2
NetP9_6: P9.6 R33.2
NetPWR_1: PWR.1(A) R26.1
NetQ1_2: Q1.2(B) R36.2 R38.2
NetR16_2: R16.2 U4.8(IRQ)
NetR17_1: R17.1 U3.9(ROUT2)
NetR19_1: R19.1 R25.2 RS485.1 U7.7(B)
NetR22_2: R22.2 R25.1 RS485.2 U7.6(A)
NetR32_1: R32.1 USB_SLAVE.2(D-)
NetR33_1: R33.1 R35.1 USB_SLAVE.3(D+)

Not connected (* = marked no-connect by the designer): COM2 1 4 6 7 8 9; COM3 5; SD_CARD 10(CD) 11(GND) 12(WP); U7 3(DE); U9 5(Vref); USB_SLAVE 4(NC)

### Notes on the sheet
- RS232&JOYPAD
- ATK MODULE
- WIRELESS
- (near C26) OLED&CAMERA
- RS485
- TEMP&HUMI SENSOR
- LED
- SD_CARD
- CAN&USB
- REMOTE
- KEY
- SPI FLASH
- ADC&DAC
- BEEP
- (near LS1) LIGHT_SENSOR
- EEPROM
- TOUCH_KEY

### Library data of the parts
C25-C40 = C
CAN RS485 = HEAD2
COM2 COM3 = DB9
D3 = ZMM3V6
DS0 DS1 PWR = LED2: Typical RED, GREEN, YELLOW, AMBER GaAs LED; Published: 8-Jun-2000; LatestRevisionDate: 17-Jul-2002; LatestRevisionNote: Re-released for DXP Platform.; PackageDocument: Feb-2002; PackageReference: 3.2X1.6X1.1; Publisher: Altium Limited
K1 = MSS-22D18: 六脚波动开关
KEY0-KEY2 KEY_UP = KEY_M
LS1 = LSENS: LIGHT SENS
P6 = Header 9X2: Header, 9-Pin, Dual row; LatestRevisionDate: 17-Jul-2002; LatestRevisionNote: Re-released for DXP Platform.; Publisher: Altium Limited
P7-P9 = Header 3X2: Header, 3-Pin, Dual row; LatestRevisionDate: 17-Jul-2002; LatestRevisionNote: Re-released for DXP Platform.; Publisher: Altium Limited
P10 = Header 4: Header, 4-Pin; LatestRevisionDate: 17-Jul-2002; LatestRevisionNote: Re-released for DXP Platform.; Publisher: Altium Limited
Q1 = NPN: 8050/BCW846/BCW847
R14-R41 = R
U3 = MAX3232
U4 = NRF24L01
U5 = ATK-HC05
U6 = DHT11: 数字温湿度传感器
U7 = MAX3485
U9 = SN65HVD230D
U10 = W25X16: W25X16;SST25VF016;MX25L1605
U11 = 24C256
USB_SLAVE = USB5

## Sheet warship_demo_4.SchDoc
size A4
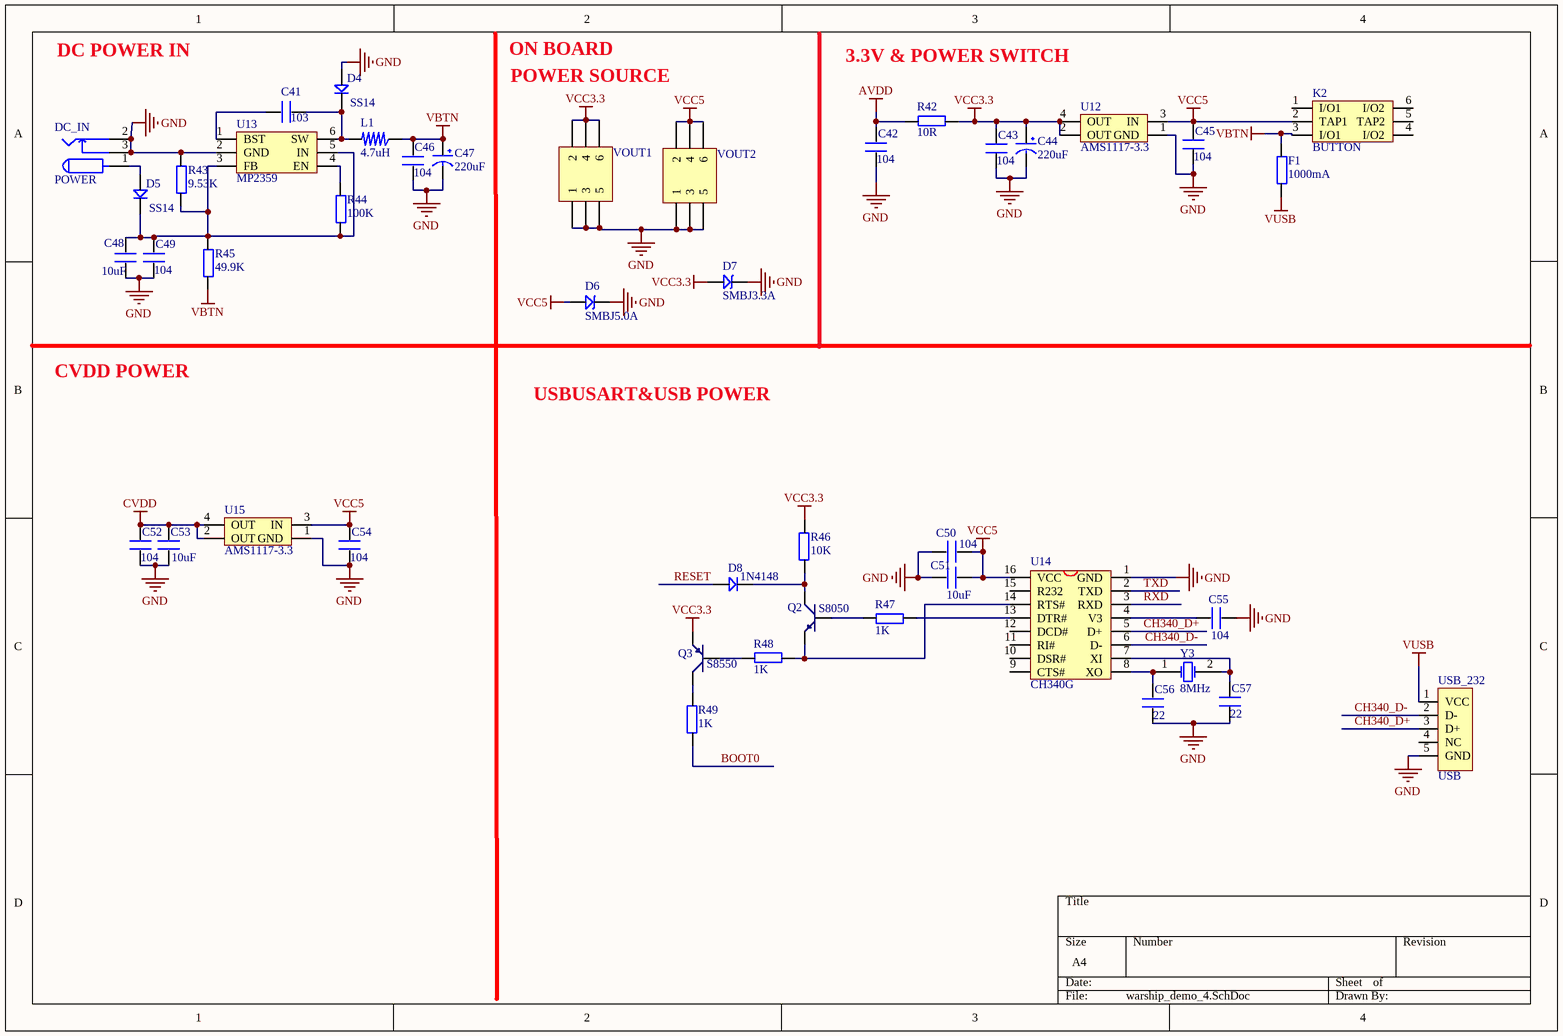
[diagram p3: warship_demo_4.SchDoc]

### Parts
C41  103  [0603P]
C42  104  [0603P]
C43  104  [0603P]
C44  220uF  [CC6.56.5]
C45  104  [0603P]
C46  104  [0603P]
C47  220uF  [CC6.56.5]
C48  10uF  [1206]
C49  104  [0603P]
C50  104  [0603P]
C51  10uF  [0805]
C52  104  [0603P]
C53  10uF  [0805]
C54  104  [0603P]
C55  104  [0603P]
C56  22  [0603P]
C57  22  [0603P]
D4  SS14  [DIODE_3*5.3]
D5  SS14  [DIODE_3*5.3]
D6  SMBJ5.0A  [SMBJ]
D7  SMBJ3.3A  [SMBJ]
D8  1N4148  [DIODE_SOP]
DC_IN  POWER  [DC10B]
F1  1000mA  [0805]
K2  BUTTON  [BTN8.5*8.5]
L1  4.7uH  [L_SOP74]
Q2  S8050  [SOT-23R]
Q3  S8550  [SOT-23R]
R42  10R  [0603P]
R43  9.53K  [0603P]
R44  100K  [0603P]
R45  49.9K  [0603P]
R46  10K  [0603P]
R47  1K  [0603P]
R48  1K  [0603P]
R49  1K  [0603P]
U12  AMS1117-3.3  [AMS1117]
U13  MP2359  [SOT-23-6]
U14  CH340G  [SOP16M]
U15  AMS1117-3.3  [AMS1117]
USB_232  USB  [USB/SM0.8-6H5]
VOUT1  Header 3X2  [HDR2X3]  (value not drawn)
VOUT2  Header 3X2  [HDR2X3]  (value not drawn)
Y3  8MHz  [XTAL_US]

### Nets
AVDD: C42.2 R42.2
CVDD: C52.2 C53.2 U15.2(OUT) U15.4(OUT)
GND: C42.1 C43.1 C44.2(GND) C45.1 C46.1 C47.2(GND) C48.1 C49.1 C50.2 C51.1 C52.1 C53.1 C54.1 C55.1 C56.1 C57.1 D4.1 D6.2 D7.2 DC_IN.2 DC_IN.3 R43.2 U12.1(GND) U13.2(GND) U14.1(GND) U15.1(GND) USB_232.5(GND) VOUT1.1 VOUT1.3 VOUT1.5 VOUT2.1 VOUT2.3 VOUT2.5
VBTN: C46.2 C47.1(VCC) F1.2 K2.3(I/O1) L1.1 R45.1
VCC3.3: C43.2 C44.1(VCC) D7.1 Q3.1(E) R42.1 R46.1 U12.2(OUT) U12.4(OUT) VOUT1.2 VOUT1.4 VOUT1.6
VCC5: C45.2 C50.1 C51.2 C54.2 D6.1 K2.2(TAP1) U12.3(IN) U14.16(VCC) U15.3(IN) VOUT2.2 VOUT2.4 VOUT2.6
VUSB: F1.1 USB_232.1(VCC)
BOOT0: R49.2
CH340_D+: U14.5(D+) USB_232.3(D+)
CH340_D-: U14.6(D-) USB_232.2(D-)
RESET: D8.1
RXD: U14.3(RXD)
TXD: U14.2(TXD)
NetC41_1: C41.1 D4.2 L1.2 U13.6(SW)
NetC41_2: C41.2 U13.1(BST)
NetC48_2: C48.2 C49.2 D5.2 R43.1 R44.1 R45.2 U13.3(FB) U13.5(IN)
NetC55_2: C55.2 U14.4(V3)
NetC56_2: C56.2 U14.8(XO) Y3.1(OSC1)
NetC57_2: C57.2 U14.7(XI) Y3.2(OSC2)
NetD5_1: D5.1 DC_IN.1
NetD8_2: D8.2 Q2.3(C) R46.2
NetQ2_1: Q2.1(E) R48.1 U14.14(RTS#)
NetQ2_2: Q2.2(B) R47.1
NetQ3_2: Q3.2(B) R48.2
NetQ3_3: Q3.3(C) R49.1
NetR44_2: R44.2 U13.4(EN)
NetR47_2: R47.2 U14.13(DTR#)

Not connected (* = marked no-connect by the designer): K2 1(I/O1) 4(I/O2) 5(TAP2) 6(I/O2); U14 9(CTS#) 10(DSR#) 11(RI#) 12(DCD#) 15(R232); USB_232 4(NC)

### Notes on the sheet
- DC POWER IN
- ON BOARD
- POWER SOURCE
- 3.3V & POWER SWITCH
- CVDD POWER
- USBUSART&USB POWER

### Library data of the parts
C41-C43 C45 C46 C48-C57 = C
C44 C47 = CAP
D4 D5 D8 = D
D6 D7 = SMBJ: TVS
DC_IN = POW
F1 R42-R49 = R
L1 = L_SOP
Q2 = NPN: 8050/BCW846/BCW847
Q3 = PNP: 8550/BCW68
U12 U15 = AMS1117
U13 = MP2359: DC DC Step Down IC
U14 = CH340G: USB2UART
USB_232 = USB5
VOUT1 VOUT2 = Header 3X2: Header, 3-Pin, Dual row; LatestRevisionDate: 17-Jul-2002; LatestRevisionNote: Re-released for DXP Platform.; Publisher: Altium Limited
Y3 = XTAL: Crystal Oscillator; Published: 8-Jun-2000; LatestRevisionDate: 17-Jul-2002; LatestRevisionNote: Re-released for DXP Platform.; Publisher: Altium Limited

## Nets that join several sheets
AVDD: warship_demo_1 (5 pins), warship_demo_4 (C42.2 R42.2)
CVDD: warship_demo_1 (8 pins), warship_demo_4 (C52.2 C53.2 U15.2 U15.4)
GND: warship_demo_1 (69 pins), warship_demo_2 (58 pins), warship_demo_3 (46 pins), warship_demo_4 (33 pins)
VCC3.3: warship_demo_1 (7 pins), warship_demo_2 (18 pins), warship_demo_3 (38 pins), warship_demo_4 (11 pins)
VCC5: warship_demo_1 (C65.1 C66.2 R59.1 U17.6), warship_demo_3 (5 pins), warship_demo_4 (12 pins)
VUSB: warship_demo_3 (USB_SLAVE.1), warship_demo_4 (F1.1 USB_232.1)
1WIRE_DQ: warship_demo_2 (P2.12 U2.126), warship_demo_3 (R27.2 U6.2)
BEEP: warship_demo_2 (P2.2 U2.139), warship_demo_3 (R36.1)
BOOT0: warship_demo_2 (R11.2 U2.138), warship_demo_4 (R49.2)
DM9000_RST: warship_demo_1 (R62.1 U18.40), warship_demo_2 (P2.15 U2.123), warship_demo_3 (U7.2)
F_CS: warship_demo_2 (P1.44 U2.73), warship_demo_3 (U10.1)
FIFO_OE: warship_demo_2 (P2.8 U2.132), warship_demo_3 (P6.7)
FIFO_RCLK: warship_demo_2 (JTAG.3 P2.6 R5.2 U2.134), warship_demo_3 (P6.16)
FIFO_RRST: warship_demo_2 (P2.9 U2.129), warship_demo_3 (P6.5)
FIFO_WEN: warship_demo_2 (JTAG.13 P2.7 R10.2 U2.133), warship_demo_3 (P6.18)
FIFO_WRST: warship_demo_2 (P2.16 U2.122), warship_demo_3 (P6.3)
FSMC_A7: warship_demo_1 (U18.32), warship_demo_2 (P1.38 U1.22 U2.53)
FSMC_D0: warship_demo_1 (U18.18), warship_demo_2 (2.4'/2.8'LCD.6 P3.1 U1.7 U2.85)
FSMC_D1: warship_demo_1 (U18.17), warship_demo_2 (2.4'/2.8'LCD.7 P3.2 U1.8 U2.86)
FSMC_D2: warship_demo_1 (U18.16), warship_demo_2 (2.4'/2.8'LCD.8 P3.3 U1.9 U2.114)
FSMC_D3: warship_demo_1 (U18.14), warship_demo_2 (2.4'/2.8'LCD.9 P3.4 U2.115)
FSMC_D4: warship_demo_1 (U18.13), warship_demo_2 (2.4'/2.8'LCD.10 P3.5 U1.13 U2.58)
FSMC_D5: warship_demo_1 (U18.12), warship_demo_2 (2.4'/2.8'LCD.11 P3.6 U1.14 U2.59)
FSMC_D6: warship_demo_1 (U18.11), warship_demo_2 (2.4'/2.8'LCD.12 P3.7 U2.60)
FSMC_D7: warship_demo_1 (U18.10), warship_demo_2 (2.4'/2.8'LCD.13 P3.8 U1.16 U2.63)
FSMC_D8: warship_demo_1 (U18.31), warship_demo_2 (2.4'/2.8'LCD.14 P3.9 U1.29 U2.64)
FSMC_D9: warship_demo_1 (U18.29), warship_demo_2 (2.4'/2.8'LCD.15 P3.10 U2.65)
FSMC_D10: warship_demo_1 (U18.28), warship_demo_2 (2.4'/2.8'LCD.16 P3.11 U1.31 U2.66)
FSMC_D11: warship_demo_1 (U18.27), warship_demo_2 (2.4'/2.8'LCD.17 P3.12 U1.32 U2.67)
FSMC_D12: warship_demo_1 (U18.26), warship_demo_2 (2.4'/2.8'LCD.18 P3.13 U2.68)
FSMC_D13: warship_demo_1 (U18.25), warship_demo_2 (2.4'/2.8'LCD.19 P3.14 U1.36 U2.77)
FSMC_D14: warship_demo_1 (U18.24), warship_demo_2 (2.4'/2.8'LCD.20 P3.15 U1.37 U2.78)
FSMC_D15: warship_demo_1 (U18.22), warship_demo_2 (2.4'/2.8'LCD.21 P3.16 U2.79)
FSMC_NE2: warship_demo_1 (R64.1 U18.37), warship_demo_2 (P2.14 U2.124)
FSMC_NOE: warship_demo_1 (U18.35), warship_demo_2 (2.4'/2.8'LCD.4 P2.18 U1.41 U2.118)
FSMC_NWE: warship_demo_1 (U18.36), warship_demo_2 (2.4'/2.8'LCD.3 P2.17 U1.17 U2.119)
GBC_KEY: warship_demo_2 (P1.25 U2.40), warship_demo_3 (P10.3 U5.2)
GBC_LED: warship_demo_2 (JTAG.5 P2.24 R6.2 U2.110), warship_demo_3 (U5.1)
IIC_SCL: warship_demo_2 (P2.4 U2.136), warship_demo_3 (R39.2 U11.6)
IIC_SDA: warship_demo_2 (P2.3 U2.137), warship_demo_3 (R40.2 U11.5)
JOY_CLK: warship_demo_2 (P2.19 U2.117), warship_demo_3 (D3.2 P6.4 R14.1)
KEY0: warship_demo_2 (P1.6 U2.3), warship_demo_3 (KEY0.2)
KEY1: warship_demo_2 (P1.3 U2.2), warship_demo_3 (KEY1.2)
KEY2: warship_demo_2 (P1.4 U2.1), warship_demo_3 (KEY2.2)
LED0: warship_demo_2 (P2.5 U2.135), warship_demo_3 (DS0.2)
LED1: warship_demo_2 (P1.5 U2.4), warship_demo_3 (DS1.2)
LIGHT_SENSOR: warship_demo_2 (P1.18 U2.20), warship_demo_3 (R37.1)
NRF_CE: warship_demo_2 (P2.32 U2.93), warship_demo_3 (U4.3)
NRF_CS: warship_demo_2 (P2.33 U2.92), warship_demo_3 (U4.4)
NRF_IRQ: warship_demo_2 (P2.34 U2.91), warship_demo_3 (R16.1)
OV_D0: warship_demo_2 (P1.19 U2.26), warship_demo_3 (P6.8)
OV_D1: warship_demo_2 (P1.22 U2.27), warship_demo_3 (P6.9)
OV_D2: warship_demo_2 (P1.21 U2.28), warship_demo_3 (P6.10)
OV_D3: warship_demo_2 (P1.24 U2.29), warship_demo_3 (P6.11)
OV_D4: warship_demo_2 (P1.29 U2.44), warship_demo_3 (P6.12)
OV_D5: warship_demo_2 (P1.32 U2.45), warship_demo_3 (P6.13)
OV_D6: warship_demo_2 (P2.31 U2.96), warship_demo_3 (P6.14)
OV_D7: warship_demo_2 (P2.30 U2.97), warship_demo_3 (P6.15)
OV_SDA: warship_demo_2 (P2.10 U2.128), warship_demo_3 (P6.6)
OV_VSYNC: warship_demo_1 (R54.1), warship_demo_2 (P2.27 U2.100), warship_demo_3 (P6.17)
PA0: warship_demo_2 (P1.26 U2.34), warship_demo_3 (KEY_UP.2)
PA1: warship_demo_2 (P1.23 U2.35), warship_demo_3 (P10.2)
PA2: warship_demo_2 (U2.36), warship_demo_3 (P7.3)
PA3: warship_demo_2 (U2.37), warship_demo_3 (P7.4)
PA5: warship_demo_1 (U19.28), warship_demo_2 (P1.28 U2.41)
PA6: warship_demo_1 (U19.30), warship_demo_2 (P1.27 U2.42)
PA7: warship_demo_1 (U19.29), warship_demo_2 (P1.30 U2.43)
PA11: warship_demo_2 (U2.103), warship_demo_3 (P9.3)
PA12: warship_demo_2 (U2.104), warship_demo_3 (P9.4)
PB9: warship_demo_2 (P2.1 U2.140), warship_demo_3 (R31.2 U8.1)
PB10: warship_demo_2 (U2.69), warship_demo_3 (P8.3)
PB11: warship_demo_2 (U2.70), warship_demo_3 (P8.4)
PB13: warship_demo_2 (P1.41 U2.74), warship_demo_3 (U4.5 U10.6)
PB14: warship_demo_2 (P2.43 U2.75), warship_demo_3 (U4.7 U10.2)
PB15: warship_demo_2 (P2.42 U2.76), warship_demo_3 (U4.6 U10.5)
PC8: warship_demo_2 (P2.29 U2.98), warship_demo_3 (R28.1 SD_CARD.7)
PC9: warship_demo_2 (P2.28 U2.99), warship_demo_3 (R29.1 SD_CARD.8)
PC10: warship_demo_2 (P2.23 U2.111), warship_demo_3 (R18.1 SD_CARD.9)
PC11: warship_demo_2 (P2.22 U2.112), warship_demo_3 (R21.1 SD_CARD.1)
PC12: warship_demo_2 (P2.21 U2.113), warship_demo_3 (SD_CARD.5)
PC13: warship_demo_1 (U19.8), warship_demo_2 (P1.7 U2.7)
PD2: warship_demo_2 (P2.20 U2.116), warship_demo_3 (R23.1 SD_CARD.2)
PE6: warship_demo_1 (U19.3), warship_demo_2 (P1.8 U2.5)
PF6: warship_demo_1 (U19.13), warship_demo_2 (P1.16 U2.18)
PF7: warship_demo_1 (U19.23), warship_demo_2 (P1.15 U2.19)
RESET: warship_demo_2 (6 pins), warship_demo_4 (D8.1)
RXD: warship_demo_2 (P4.4), warship_demo_4 (U14.3)
TXD: warship_demo_2 (P4.2), warship_demo_4 (U14.2)